# EAGLE design Drone-dimension (EAGLE 9.6.2)
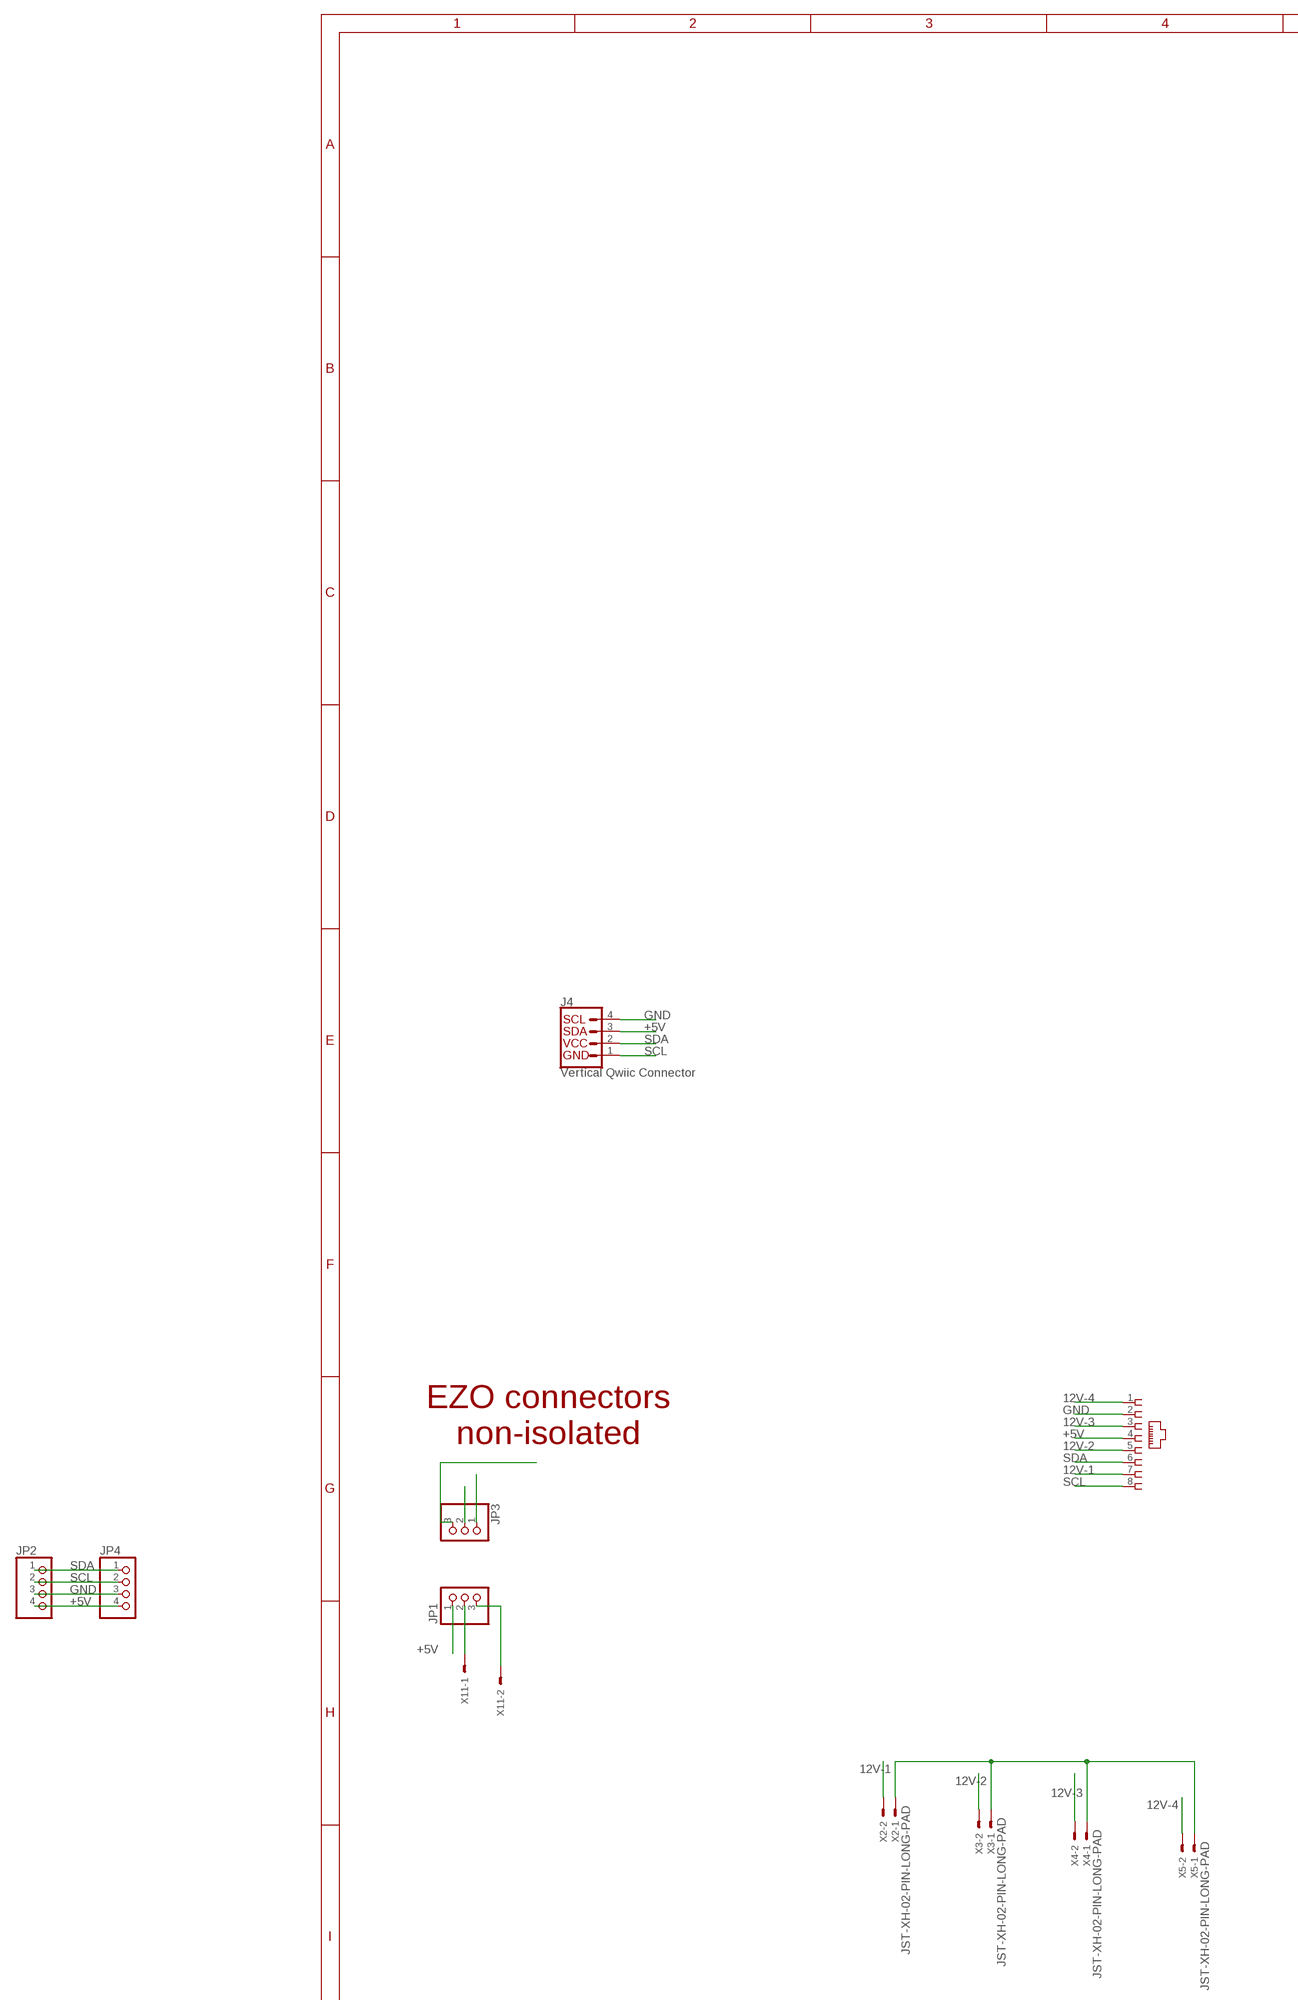
[diagram p0: schematic, sheet 1, part 1 of 2]
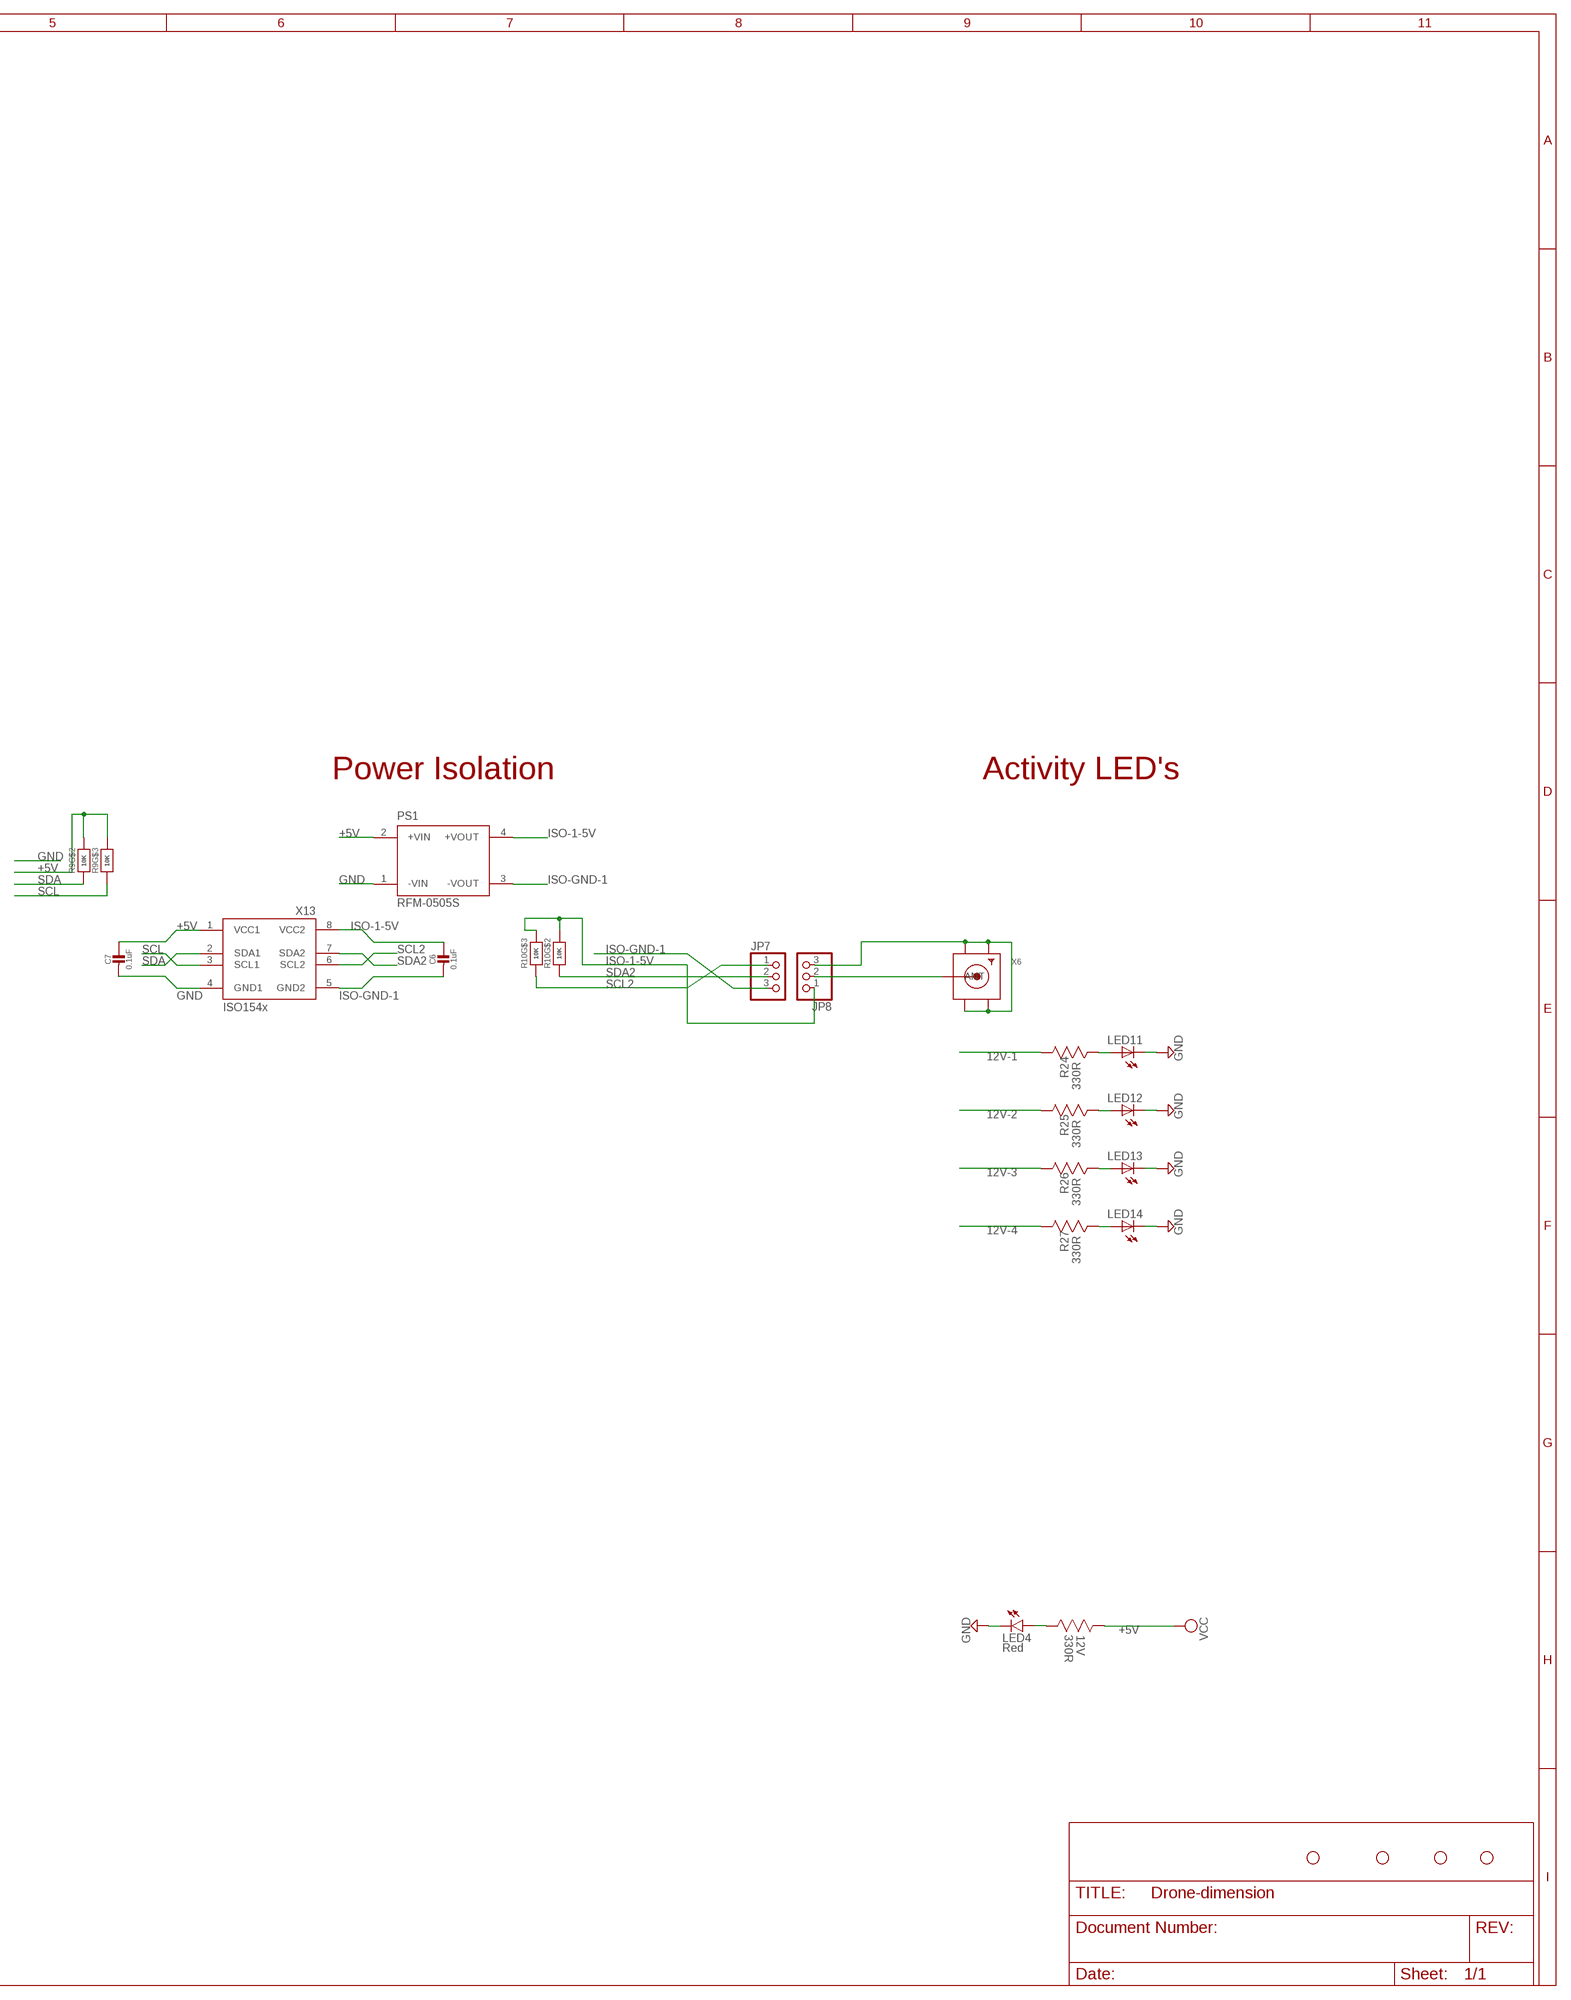
[diagram p1: schematic, sheet 1, part 2 of 2]

## Parts
12V  330R  MC0.063W06031%330R  [RESC1608X60N]
C6  0.1uF  CAP_CERAMIC0603_NO  [0603-NO]
C7  0.1uF  CAP_CERAMIC0603_NO  [0603-NO]
H5  STAND-OFF  [STAND-OFF]
H6  STAND-OFF  [STAND-OFF]
H7  STAND-OFF  [STAND-OFF]
H8  STAND-OFF  [STAND-OFF]
J4  Vertical Qwiic Connector  QWIIC_CONNECTOR  [JST04_1MM_VERT]
JP1  PINHD-1X3CB  [1X03-CLEANBIG]
JP2  PINHD-1X4  [1X04]
JP3  PINHD-1X3CB  [1X03-CLEANBIG]
JP4  PINHD-1X4  [1X04]
JP7  PINHD-1X3CB  [1X03-CLEANBIG]
JP8  PINHD-1X3CB  [1X03-CLEANBIG]
LED4  Red  LED-RED-0603-WE  [LED-0603]
LED11  BLUE  LEDCHIPLED_0805  [CHIPLED_0805]
LED12  GREEN  LEDCHIPLED_0805  [CHIPLED_0805]
LED13  Yellow  LEDCHIPLED_0805  [CHIPLED_0805]
LED14  RED  LEDCHIPLED_0805  [CHIPLED_0805]
PS1  RFM-0505S  [CONV_RFM-0505S]
PUMPBOX-2  RJ45-6L-B  [RJ45-NO-SHIELD]
R9  10K  RESISTOR_4PACK  [RESPACK_4X0603]
R10  10K  RESISTOR_4PACK  [RESPACK_4X0603]
R24  330R  MC0.063W06031%330R  [RESC1608X60N]
R25  330R  MC0.063W06031%330R  [RESC1608X60N]
R26  330R  MC0.063W06031%330R  [RESC1608X60N]
R27  330R  MC0.063W06031%330R  [RESC1608X60N]
X2  JST-XH-02-PIN-LONG-PAD  [JST-XH-02-PACKAGE-LONG-PAD]
X3  JST-XH-02-PIN-LONG-PAD  [JST-XH-02-PACKAGE-LONG-PAD]
X4  JST-XH-02-PIN-LONG-PAD  [JST-XH-02-PACKAGE-LONG-PAD]
X5  JST-XH-02-PIN-LONG-PAD  [JST-XH-02-PACKAGE-LONG-PAD]
X6  SMACONNECTOR  [SMA90_DIP]
X11  jst-xh-2  JST-XH-02-PIN-LONG-PAD  [JST-XH-02-PACKAGE-LONG-PAD]
X13  ISO154X  [SOIC8_150MIL]

## Nets
12V-1: PUMPBOX-2.7 R24.1(R1) X2.2
12V-2: PUMPBOX-2.5 R25.1(R1) X3.2
12V-3: PUMPBOX-2.3 R26.1(R1) X4.2
12V-4: PUMPBOX-2.1 R27.1(R1) X5.2
+5V [5v]: 12V.1(R1) C7.1 J4.3 JP1.1 JP2.4 JP4.4 PS1.2(+VIN) PUMPBOX-2.4 R9.6 R9.7 X13.1(VCC1) ; supply symbol labelled VCC
GND: C7.2 J4.4 JP2.3 JP3.3 JP4.3 LED4.C LED11.C LED12.C LED13.C LED14.C PS1.1(-VIN) PUMPBOX-2.2 X2.1 X3.1 X4.1 X5.1 X13.4(GND1)
ISO-1-5V: C6.1 JP8.1 PS1.4(+VOUT) R10.6 R10.7 X13.8(VCC2)
ISO-GND-1: C6.2 JP7.3 PS1.3(-VOUT) X13.5(GND2)
N$1: JP1.2 X11.1
N$2: JP3.2
N$3: JP1.3 X11.2
N$14: JP8.3 X6.GND1 X6.GND2 X6.GND3 X6.GND4
N$16: JP8.2 X6.ANTENNA(ANT)
N$47: 12V.2(R2) LED4.A
N$54 [GPIO]: LED11.A R24.2(R2)
N$55 [GPIO]: LED12.A R25.2(R2)
N$56 [GPIO]: LED13.A R26.2(R2)
N$57 [GPIO]: LED14.A R27.2(R2)
SCL: J4.1 JP2.2 JP3.1 JP4.2 PUMPBOX-2.8 R9.3 X13.3(SCL1)
SCL2: JP7.1 R10.3 X13.6(SCL2)
SDA: J4.2 JP2.1 JP4.1 PUMPBOX-2.6 R9.2 X13.2(SDA1)
SDA2: JP7.2 R10.2 X13.7(SDA2)
Unconnected: R9.1 R9.4 R9.5 R9.8 R10.1 R10.4 R10.5 R10.8

## Notes on the sheet
- Power Isolation | Activity LED's
- EZO connectors
  non-isolated

## Library data of the parts
12V R24-R27 = Multicomp:MC0.063W06031%330R: RESISTOR, 0603; MPN: MC0.063W06031%330R; OC_FARNELL: 9331018; OC_NEWARK: -; SUPPLIER: Multicomp; TOLERANCE: ±1%; VALUE: 330 Ohms; WATTAGE: 1/16 W
C6 C7 = microbuilder:CAP_CERAMIC: Ceramic Capacitors For new designs, use the packages preceded by an '_' character since they are more reliable: The following footprints should be used on most boards: _0402 - Standard footprint for regular board layouts _0603 - Standard footprint for regular board layouts _0805 - Standard footprint for regular board layouts _1206 - Standard footprint for regular board layouts For extremely tight-pitch boards where space is at a premium, the following 'micro-pitch' footprints can be used (smaller pads, no silkscreen outline, etc.): _0402MP - Micro-pitch footprint for very dense/compact boards _0603MP - Micro-pitch footprint for very dense/compact boards _0805MP - Micro-pitch footprint for very dense/compact boards _1206MP - Micro-pitch footprint for very dense/compact boards
H5-H8 = SparkFun-Hardware:STAND-OFF: Stand Off Drill holes for mechanically mounting via screws, standoffs, etc. Note: Use the keepout ring to avoid running the screw head into surrounding components. Variant Overviews STAND-OFF - Mechanical footprint for a #4 phillips button head screw. STAND-OFF-TIGHT - Mechanical footprint for a #4 phillips button head screw, Example SparkFun Products Screw - Phillips Head (1/4", 4-40, 10 pack) <https://www.sparkfun.com/products/10453> (PRT-10453) Screw - Phillips Head (1/2", 4-40, 10 pack) <https://www.sparkfun.com/products/10452> (PRT-10452) Screw - Phillips Head (3/4", 4-40, 10 pack) <https://www.sparkfun.com/products/10451> (PRT-10451) Screw - Phillips Head (1", 4-40, 10 pack) <https://www.sparkfun.com/products/10450> (PRT-10450)
J4 = SparkFun-Connectors:QWIIC_CONNECTOR: SparkFun I2C Standard Qwiic Connector An SMD 1mm pitch JST connector makes it easy and quick (get it? Qwiic?) to connect I2C devices to each other. The Qwiic system <http://www.sparkfun.com/qwiic> enables fast and solderless connection between popular platforms and various sensors and actuators. We carry 200mm <https://www.sparkfun.com/products/14204>, 100mm <https://www.sparkfun.com/products/14205>, 50mm <https://www.sparkfun.com/products/14206>, and breadboard friendly <https://www.sparkfun.com/products/14207> Qwiic cables. We also offer 10 pcs strips <https://www.sparkfun.com/products/14323> the SMD connectors.; PROD_ID: CONN-14483
JP1 JP3 JP7 JP8 = adafruit:PINHD-1X3: PIN HEADER
JP2 JP4 = pinhead:PINHD-1X4: PIN HEADER
LED4 = SparkFun-LED:LED-RED: Red SMD LED Used in manufacturing of most products at SparkFun Packages: 0603 - SMD 0603 package [Product Link] <http://docs.avagotech.com/docs/AV02-0551EN> 0603 SMART - SMD 0603 SMART package ( more efficient and expensive)[Product Link] <http://www.osram-os.com/Graphics/XPic2/00077099_0.pdf> 1206 - SMD1206 package [Product Link] <https://www.sparkfun.com/datasheets/DevTools/LilyPad/Q150OVS4.pdff> SparkFun Products: Pro Mini 328 -5V <https://www.sparkfun.com/products/821> RedBoard <https://www.sparkfun.com/products/12757> IOIO-OTG <https://www.sparkfun.com/products/13613>; PROD_ID: DIO-16511
LED11-LED14 = adafruit:LED: LED OSRAM: - CHIPLED LG R971, LG N971, LY N971, LG Q971, LY Q971, LO R971, LY R971 LH N974, LH R974 LS Q976, LO Q976, LY Q976 LO Q996 - Hyper CHIPLED LW Q18S LB Q993, LB Q99A, LB R99A - SideLED LS A670, LO A670, LY A670, LG A670, LP A670 LB A673, LV A673, LT A673, LW A673 LH A674 LY A675 LS A676, LA A676, LO A676, LY A676, LW A676 LS A679, LY A679, LG A679 - Hyper Micro SIDELED® LS Y876, LA Y876, LO Y876, LY Y876 LT Y87S - SmartLED LW L88C, LW L88S LB L89C, LB L89S, LG L890 LS L89K, LO L89K, LY L89K LS L896, LA L896, LO L896, LY L896 - TOPLED LS T670, LO T670, LY T670, LG T670, LP T670 LSG T670, LSP T670, LSY T670, LOP T670, LYG T670 LG T671, LOG T671, LSG T671 LB T673, LV T673, LT T673, LW T673 LH T674 LS T676, LA T676, LO T676, LY T676, LB T676, LH T676, LSB T676, LW T676 LB T67C, LV T67C, LT T67C, LS T67K, LO T67K, LY T67K, LW E67C LS E67B, LA E67B, LO E67B, LY E67B, LB E67C, LV E67C, LT E67C LW T67C LS T679, LY T679, LG T679 LS T770, LO T770, LY T770, LG T770, LP T770 LB T773, LV T773, LT T773, LW T773 LH T774 LS E675, LA E675, LY E675, LS T675 LS T776, LA T776, LO T776, LY T776, LB T776 LHGB T686 LT T68C, LB T68C - Hyper Mini TOPLED® LB M676 - Mini TOPLED Santana® LG M470 LS M47K, LO M47K, LY M47K Source: http://www.osram.convergy.de/
PS1 = RFM-0505S:RFM-0505S: DC/DC Converter, 1 Watt, SIP4, Single Output Check availability <https://pricing.snapeda.com/parts/RFM-0505S/Recom%20Power/view-part?ref=eda>; AVAILABILITY: In Stock; DESCRIPTION: 1W DC/DC-Converter 'ECONOLINE' SIP4 1kV unreg; MF: Recom Power; MP: RFM-0505S; PACKAGE: SIP-4 Recom Power; PRICE: None; PURCHASE-URL: https://pricing.snapeda.com/search/part/RFM-0505S/?ref=eda
PUMPBOX-2 = con-tycoelectronics:RJ45: CORCOM Modular RJ Jacks No Shield Source: www.tycoelectronics.com .. ENG_DS_1654001_1099_RJ_L_0507.pdf; MPN: RJ45-6L-B; OC_FARNELL: unknown; OC_NEWARK: 16R6090
R9 R10 = microbuilder:RESISTOR_4PACK: Resistor Packs (4 resistors) 4 x 0603 10K 1/16W - Digikey: YC164J-10KCT-ND
X2-X5 X11 = Rembrandt Electronics - JST XH Connectors v1-0:JST-XH-02-PIN: JST XH Connector 2 Pin Wire to board connector. Pitch: 2,54 mm, (0.100") Number of pins: 2 Created by Rembrandt Electronics www.rembrandtelectronics.com
X6 = adafruit:SMACONNECTOR: SMA Connector 90° DIP SMA Connector, 50 Ohm (4UConnector: 07259)
X13 = adafruit_power:ISO154X

## Net classes
0 default: width 0.356 mm, drill 0.102 mm, clearance 0.254 mm
1 highpower: width 0.356 mm, drill 0.356 mm
2 12v: width 0.457 mm, drill 0.102 mm, clearance 0.254 mm
3 5v: width 0.406 mm, drill 0.102 mm, clearance 0.254 mm
4 3.3v: width 0.406 mm, drill 0.102 mm, clearance 0.254 mm
5 i2c: width 0.356 mm, drill 0.102 mm, clearance 0.254 mm
6 GPIO: width 0.356 mm, drill 0.102 mm, clearance 0.254 mm
8 New Class: drill 0.102 mm, clearance 0.152 mm

## Board
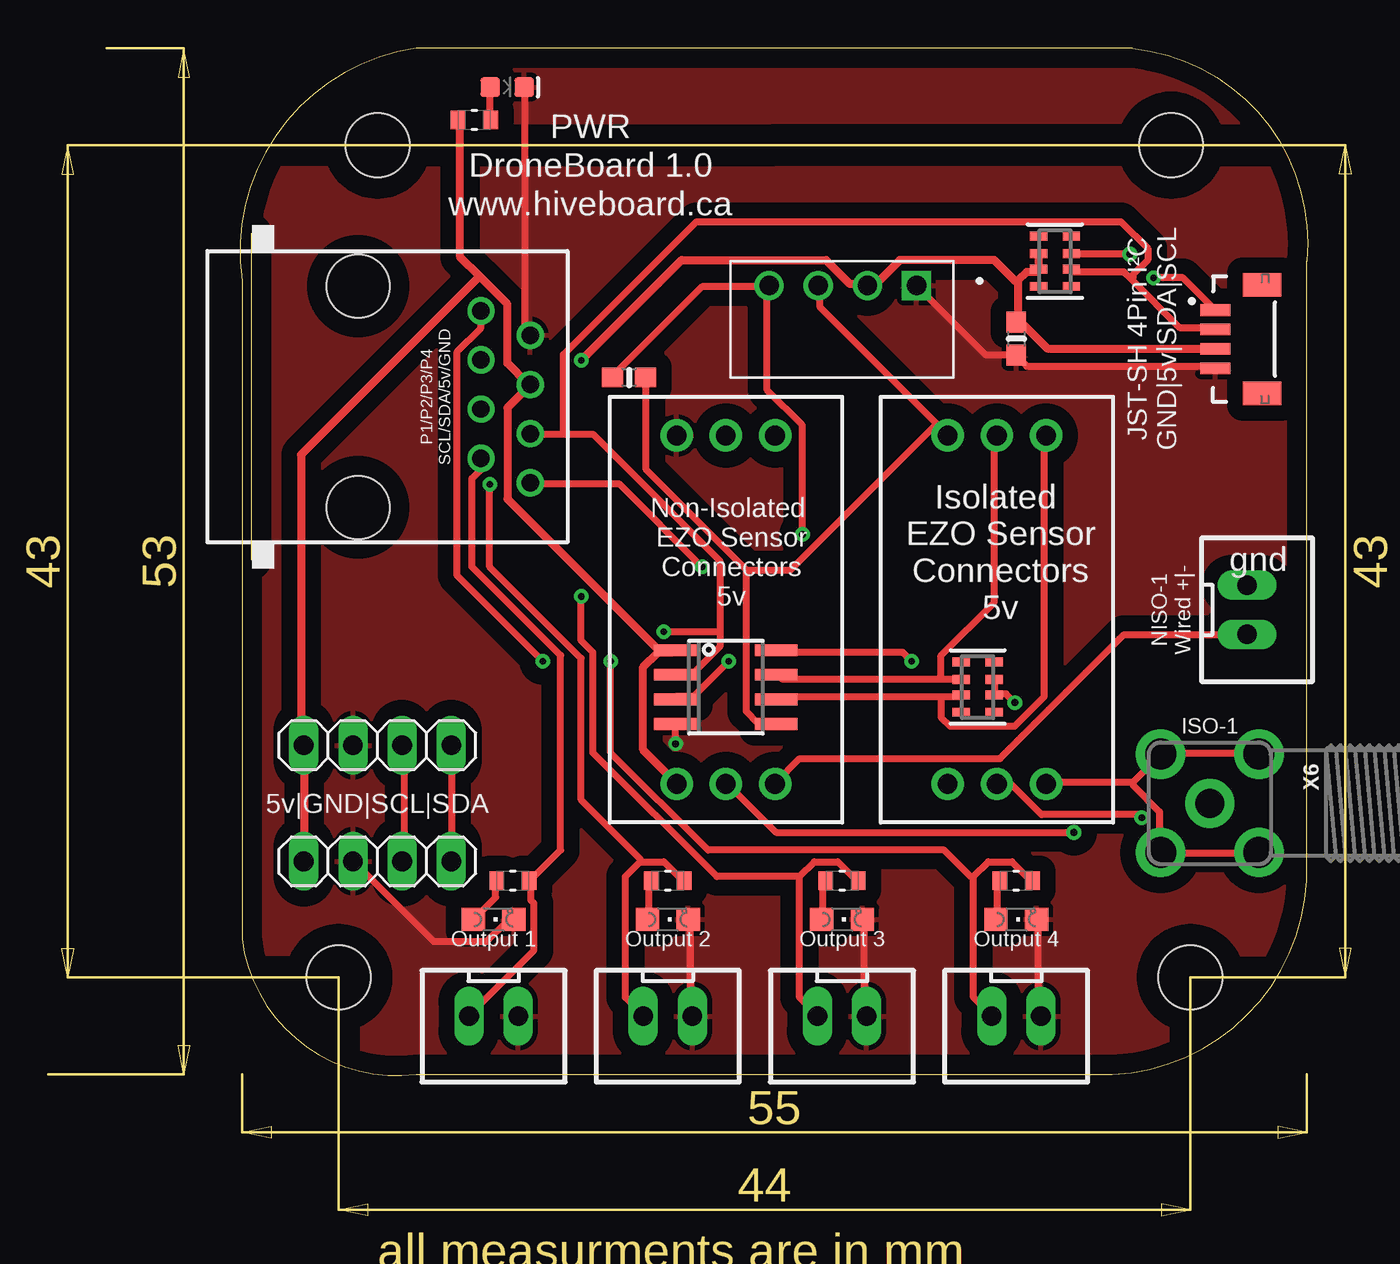
[diagram p2: board, top side]
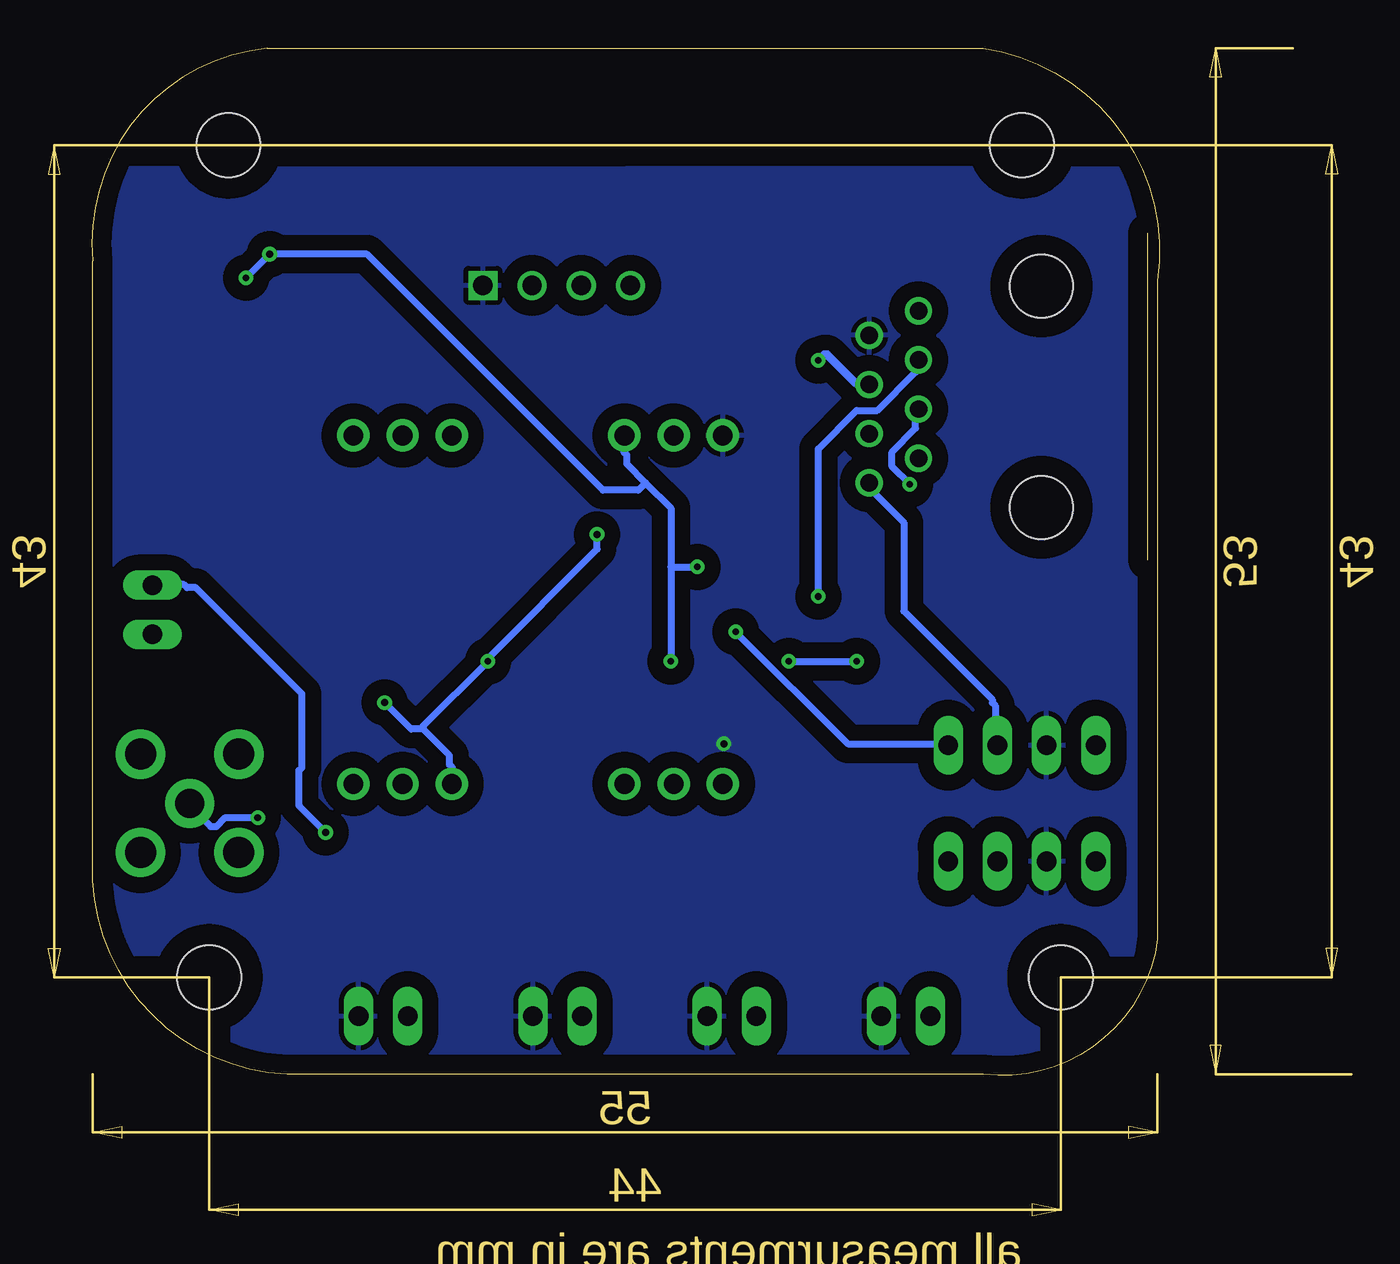
[diagram p3: board, bottom side, seen from below]

Size 55.15 x 53.06 mm. Coordinates in mm from the lower left corner, seen from the top.
Outline: 9.1,0.06 44.1,0.06 arc90 55.1,10.06 55.1,42.06 arc90 46.1,53.06 9.1,53.06 arc90 0.1,41.06 0.1,7.06 arc90 9.1,0.06
Copper layers (1*16): Top 0.035mm / dielectric 1.5mm / Bottom 0.035mm
Design rules "default *": minimum track width 6mil, minimum drill 0.35mm, track to track 6mil, track to pad 6mil, pad to pad 6mil, via to via 6mil, smd to smd 6mil, copper to edge 40mil, drill to drill 6mil, minimum pad ring 10mil, minimum via ring 8mil, stop-mask expansion 4mil, vias tented up to drill 0mil, thermal gap 10mil

### Footprints (pad centres in the part's own frame; a part is rotated, then mirrored left to right if it is on the bottom)
RESC1608X60N = smd 0.762 x 0.94: 1 -0.838,0; 2 0.838,0
0603-NO = smd 1.075 x 1: 1 -0.85,0; 2 0.85,0
STAND-OFF = hole 3.302: 0,0
JST04_1MM_VERT = smd 0.6 x 1.55: 1 -1.478,0.775; 2 -0.478,0.775; 3 0.522,0.775; 4 1.522,0.775 | smd 1.2 x 2: NC1 -2.778,3.2; NC2 2.822,3.2
1X03-CLEANBIG = drill 1.016 pad 1.676: 1 -2.54,0; 2 0,0; 3 2.54,0
1X04 = drill 1.016 long: 1 -3.81,0; 2 -1.27,0; 3 1.27,0; 4 3.81,0
LED-0603 = smd 1 x 1: A -0.877,0; C 0.877,0
CHIPLED_0805 = smd 1.2 x 1.2: A 0,-1.05; C 0,1.05
CONV_RFM-0505S = drill 1 square: 1 -3.85,-1.75 | drill 1: 2 -1.31,-1.75; 3 1.23,-1.75; 4 3.77,-1.75
RJ45-NO-SHIELD = drill 0.9 pad 1.4: 1 -4.445,6.35; 2 -3.175,8.89; 3 -1.905,6.35; 4 -0.635,8.89; 5 0.635,6.35; 6 1.905,8.89; 7 3.175,6.35; 8 4.445,8.89 | hole 3.251: -5.715,0; 5.715,0
RESPACK_4X0603 = smd 0.45 x 0.9: 1 -1.3,-0.85; 2 -0.4,-0.85; 3 0.4,-0.85; 4 1.3,-0.85; 5 1.3,0.85; 6 0.4,0.85; 7 -0.4,0.85; 8 -1.3,0.85
JST-XH-02-PACKAGE-LONG-PAD = drill 1.016 long: 1 -1.27,0; 2 1.27,0
SMA90_DIP = drill 1.5 pad 2.54: ANTENNA 0,0 | drill 1.6 pad 2.54: GND1 -2.54,2.54; GND2 2.54,2.54; GND3 -2.54,-2.54; GND4 2.54,-2.54
SOIC8_150MIL = smd 0.6 x 2.2: 1 -1.905,-2.6; 2 -0.635,-2.6; 3 0.635,-2.6; 4 1.905,-2.6; 5 1.905,2.6; 6 0.635,2.6; 7 -0.635,2.6; 8 -1.905,2.6

### Placement (x,y rotation side)
12V  12.1,49.36 0 top
C6  20.1,36.06 0 top
C7  40.1,38.06 270 top
H5  7.1,48.06 0 top
H6  5.1,5.06 0 top
H7  49.1,5.06 0 top
H8  48.1,48.06 0 top
J4  49.6,38.06 270 top
JP1  25.1,15.06 0 top
JP2  7.1,17.06 180 top
JP3  25.1,33.06 180 top
JP4  7.1,11.06 180 top
JP7  39.1,33.06 180 top
JP8  39.1,15.06 0 top
LED4  13.8,51.06 0 top
LED11  13.1,8.06 270 top
LED12  22.1,8.06 270 top
LED13  31.1,8.06 270 top
LED14  40.1,8.06 270 top
PS1  31.1,39.06 180 top
PUMPBOX-2  6.1,35.06 270 top
R9  42.1,42.06 90 top
R10  38.1,20.06 270 top
R24  14.1,10.06 180 top
R25  22.1,10.06 180 top
R26  31.1,10.06 180 top
R27  40.1,10.06 180 top
X2  13.1,3.06 180 top
X3  22.1,3.06 180 top
X4  31.1,3.06 180 top
X5  40.1,3.06 180 top
X6  50.1,14.06 270 top
X11  52.02,24.06 270 top
X13  25.1,20.06 270 top

### Tracks (layer width: path | path; a pad name or v marks a point on that pad's centre or on a via)
12V-1
  Top 0.356: X2.2 11.83,3.11 15.18,6.46 15.18,8.9 15.03,9.05 15.03,9.96 R24.1 15.03,10.12 16.56,11.64 16.56,21.7 11.98,26.27 11.98,30.84 12.44,31.3 12.44,31.76 PUMPBOX-2.7
12V-2  (via drill 0.35)
  Top 0.356: 20.67,11.03 21.89,11.03 22.8,10.12 R25.1 | 20.67,11.03 19.91,10.27 19.91,4.02 20.82,3.11 X3.2 | v12.9,30.54 12.9,26.27 17.62,21.55 17.62,14.23 20.67,11.18 20.67,11.03
  Bottom 0.356: v12.9,30.54 13.81,31.45 13.81,32.21 12.59,33.43 12.59,34.35 PUMPBOX-2.5
12V-3  (via drill 0.35)
  Top 0.356: 28.9,10.27 29.66,11.03 30.88,11.03 31.8,10.12 R26.1 | 28.9,10.27 28.9,4.02 29.81,3.11 X4.2 | v17.62,24.75 17.62,22.46 18.23,21.85 18.23,16.67 24.63,10.27 28.9,10.27
  Bottom 0.356: v17.62,24.75 17.62,32.37 15.64,34.35 14.57,34.35 12.59,36.33 12.59,36.94 PUMPBOX-2.3
12V-4  (via drill 0.35)
  Top 0.356: 37.89,10.27 38.65,11.03 39.87,11.03 40.79,10.12 R27.1 | 37.89,10.27 37.89,4.02 38.81,3.11 X5.2 | v15.64,21.39 11.22,25.81 11.22,37.4 12.44,38.62 12.44,39.38 PUMPBOX-2.1 | v19.15,21.39 19.15,16.67 24.18,11.64 36.37,11.64 37.74,10.27 37.89,10.27
  Bottom 0.356: v19.15,21.39 v15.64,21.39
+5V  (via drill 0.35)
  Top 0.406: R9.6 41.24,42.43 R9.7 41.09,41.51 40.63,41.51 40.18,41.05 | 40.18,41.05 40.18,38.92 C7.1 40.33,38.92 41.7,37.55 50.24,37.55 J4.3 | 40.18,41.05 40.03,41.05 38.96,42.12 34.08,42.12 32.86,40.9 32.56,40.9 PS1.2 32.25,40.9 31.49,40.9 30.27,42.12 22.8,42.12 v17.62,36.94 | JP1.1 22.5,15.15 20.82,16.82 20.82,21.09 21.58,21.85 22.35,21.85 X13.1 21.58,22 13.81,29.78 13.81,34.5 14.88,35.57 PUMPBOX-2.4 14.88,35.72 13.81,36.79 13.81,39.83 12.36,41.28 | JP4.4 3.3,11.18 3.3,16.97 JP2.4 3.14,17.13 3.14,32.06 12.36,41.28 | 12.36,41.28 11.37,42.27 11.37,49.28 12V.1
  Bottom 0.406: v17.62,36.94 17.32,37.24 17.17,37.24 15.64,35.72 15.03,35.72 PUMPBOX-2.4
GND  (via drill 0.35)
  Top 0.356: LED4.C 14.73,50.96 14.73,38.46 14.88,38.31 PUMPBOX-2.2 | PS1.1 35,40.75 38.5,37.24 40.03,37.24 C7.2 40.18,37.09 40.63,36.63 50.24,36.63 J4.4 | LED11.C 14.12,7.98 13.81,7.98 12.75,6.92 10,6.92 5.89,11.03 JP4.3 | LED12.C 23.26,7.98 23.26,3.11 X3.1 | LED13.C 32.25,7.98 32.25,3.11 X4.1 | LED14.C 41.24,7.98 41.24,3.11 X5.1 | v22.5,17.13 22.5,18.04 X13.4
  pour Bottom (isolate 0.813): 0.1,0.06 55.1,0.06 55.1,32.06 55.1,53.06 27.1,53.06 0.1,53.06
  pour Top (isolate 0.813): 0.1,0.06 55.1,0.06 55.1,34.06 55.1,53.06 22.1,53.06 0.1,53.06
ISO-1-5V  (via drill 0.35)
  Top 0.356: C6.1 19.3,36.18 23.87,40.75 27.22,40.75 PS1.4 27.22,40.6 27.22,35.42 29.05,33.59 v29.05,27.95 | R10.7 38.96,20.33 38.96,19.72 R10.6 39.11,19.72 39.57,19.72 v40.03,19.26 | v34.69,21.39 34.23,21.85 27.83,21.85 X13.8
  Bottom 0.356: v40.03,19.26 38.65,17.89 38.04,17.89 | 38.04,17.89 36.67,16.52 36.67,16.06 36.52,15.91 36.52,15.15 JP8.1 | 38.04,17.89 38.04,18.04 v34.69,21.39 34.69,21.55 29.05,27.19 v29.05,27.95
ISO-GND-1
  Top 0.356: PS1.3 29.97,40.75 29.97,39.68 36.52,33.13 JP7.3 35.91,33.59 28.44,26.12 26.16,26.12 | 26.16,26.12 20.98,31.3 20.98,36.02 C6.2 | 26.16,26.12 26.16,18.8 26.77,18.19 27.68,18.19 X13.5
N$1  (via drill 0.35)
  Top 0.356: v43.07,12.56 27.68,12.56 25.24,14.99 JP1.2
  Bottom 0.356: v43.07,12.56 44.44,13.93 44.44,15.76 44.29,15.91 44.29,19.72 49.78,25.2 50.24,25.2 50.39,25.36 51.91,25.36 X11.1
N$3
  Top 0.356: X11.2 51.91,22.77 45.66,22.77 39.26,16.37 28.9,16.37 27.68,15.15 JP1.3
N$14
  Top 0.356: 46.12,15.15 41.7,15.15 JP8.3 | 46.12,15.15 47.49,16.52 X6.GND3 47.65,16.67 52.52,16.67 X6.GND1 | 46.12,15.15 46.12,14.99 47.49,13.62 47.49,11.64 X6.GND4 47.65,11.49 52.52,11.49 X6.GND2
N$16  (via drill 0.35)
  Top 0.356: v46.58,13.32 46.43,13.47 41.4,13.47 39.87,14.99 39.11,14.99 JP8.2
  Bottom 0.356: v46.58,13.32 48.25,13.32 48.71,12.86 49.02,12.86 50.08,13.93 X6.ANTENNA
N$47
  Top 0.356: 12V.2 12.9,49.44 12.9,50.96 LED4.A
N$54
  Top 0.356: R24.2 13.2,9.96 13.2,9.2 12.14,8.14 LED11.A
N$55
  Top 0.356: R25.2 21.13,9.96 21.13,8.14 LED12.A
N$56
  Top 0.356: R26.2 30.12,9.96 30.12,8.14 LED13.A
N$57
  Top 0.356: R27.2 39.11,9.96 39.11,8.14 LED14.A
SCL  (via drill 0.35)
  Top 0.356: JP4.2 8.48,11.18 8.48,16.97 JP2.2 | v45.97,42.43 43.07,42.43 R9.3 | v47.19,41.21 48.71,41.21 50.24,39.68 J4.1 | v25.24,21.39 23.41,19.57 22.5,19.57 X13.3 | v23.87,26.27 19.6,30.54 15.03,30.54 PUMPBOX-2.8
  Bottom 0.356: v47.19,41.21 v45.97,42.43 40.94,42.43 28.75,30.23 26.92,30.23 26.54,30.61 | 25.24,26.27 25.24,29.32 26.54,30.61 | 25.24,26.27 v25.24,21.39 | 26.54,30.61 27.53,31.61 27.53,32.06 27.68,32.21 27.68,32.98 JP3.1 | 25.24,26.27 v23.87,26.27 | JP2.2 8.48,17.13 8.48,19.11 8.63,19.26 8.63,19.41 13.2,23.99 13.2,28.56 14.88,30.23 14.88,30.54 PUMPBOX-2.8
SCL2
  Top 0.356: 36.22,19.57 27.83,19.57 X13.6 | 36.22,19.57 37.13,19.57 R10.3 | 36.22,19.57 36.22,18.5 36.67,18.04 40.03,18.04 41.55,19.57 41.55,32.98 JP7.1
SDA  (via drill 0.35)
  Top 0.356: JP4.1 10.92,11.18 10.92,16.97 JP2.1 | 46.05,41.13 48.56,38.62 50.24,38.62 J4.2 | 46.05,41.13 45.66,41.51 43.07,41.51 R9.2 | 24.79,22.92 24.79,26.58 18.23,33.13 16.71,33.13 | 24.79,22.92 24.79,22.16 23.41,20.78 22.5,20.78 X13.2 | 16.71,33.13 15.03,33.13 PUMPBOX-2.6 | 16.71,33.13 16.71,37.24 23.57,44.1 45.51,44.1 46.88,42.73 46.88,42.12 46.12,41.36 46.12,41.21 46.05,41.13 | 24.79,22.92 v21.89,22.92
  Bottom 0.356: v21.89,22.92 16.1,17.13 10.92,17.13 JP2.1
SDA2
  Top 0.356: 36.22,20.48 27.99,20.48 27.83,20.63 X13.7 | 36.22,20.48 37.13,20.48 R10.2 | 36.22,20.48 36.22,21.7 38.96,24.44 38.96,32.98 JP7.2

### Text on the board
Dimension: all measurments are in mm | hiveboard.ca
tPlace: PWR | DroneBoard 1.0 | www.hiveboard.ca | JST-SH 4Pin I²C / GND|5v|SDA|SCL | P1/P2/P3/P4 / SCL/SDA/5v/GND | Non-Isolated / EZO Sensor / Connectors / 5v | Isolated / EZO Sensor / Connectors / 5v | gnd | NISO-1 / Wired +|- | ISO-1 | 5v|GND|SCL|SDA | Output 1 | Output 2 | Output 3 | Output 4